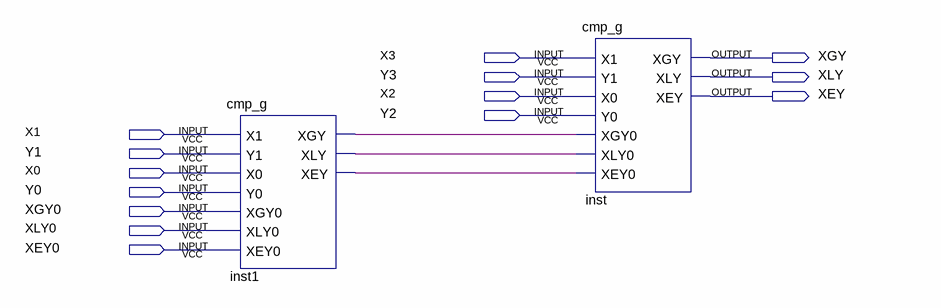
[diagram p0: schematic sheet]
// Quartus schematic cmp4_g.bdf as structural Verilog: 2 symbols, 14 pins
module cmp4_g (
  input  X3,
  input  Y3,
  input  X2,
  input  Y2,
  input  X1,
  input  Y1,
  input  X0,
  input  Y0,
  input  XGY0,
  input  XLY0,
  input  XEY0,
  output XGY,
  output XLY,
  output XEY
);

  wire inst1_xey, inst1_xgy, inst1_xly;

  cmp_g inst1 (
    .X1(X1), .Y1(Y1), .X0(X0), .Y0(Y0), .XGY0(XGY0), .XLY0(XLY0), .XEY0(XEY0), .XGY(inst1_xgy),
    .XLY(inst1_xly), .XEY(inst1_xey));
  cmp_g inst (
    .X1(X3), .Y1(Y3), .X0(X2), .Y0(Y2), .XGY0(inst1_xgy), .XLY0(inst1_xly), .XEY0(inst1_xey), .XGY(XGY),
    .XLY(XLY), .XEY(XEY));
endmodule
